# EAGLE design MI (EAGLE 7.6.0)
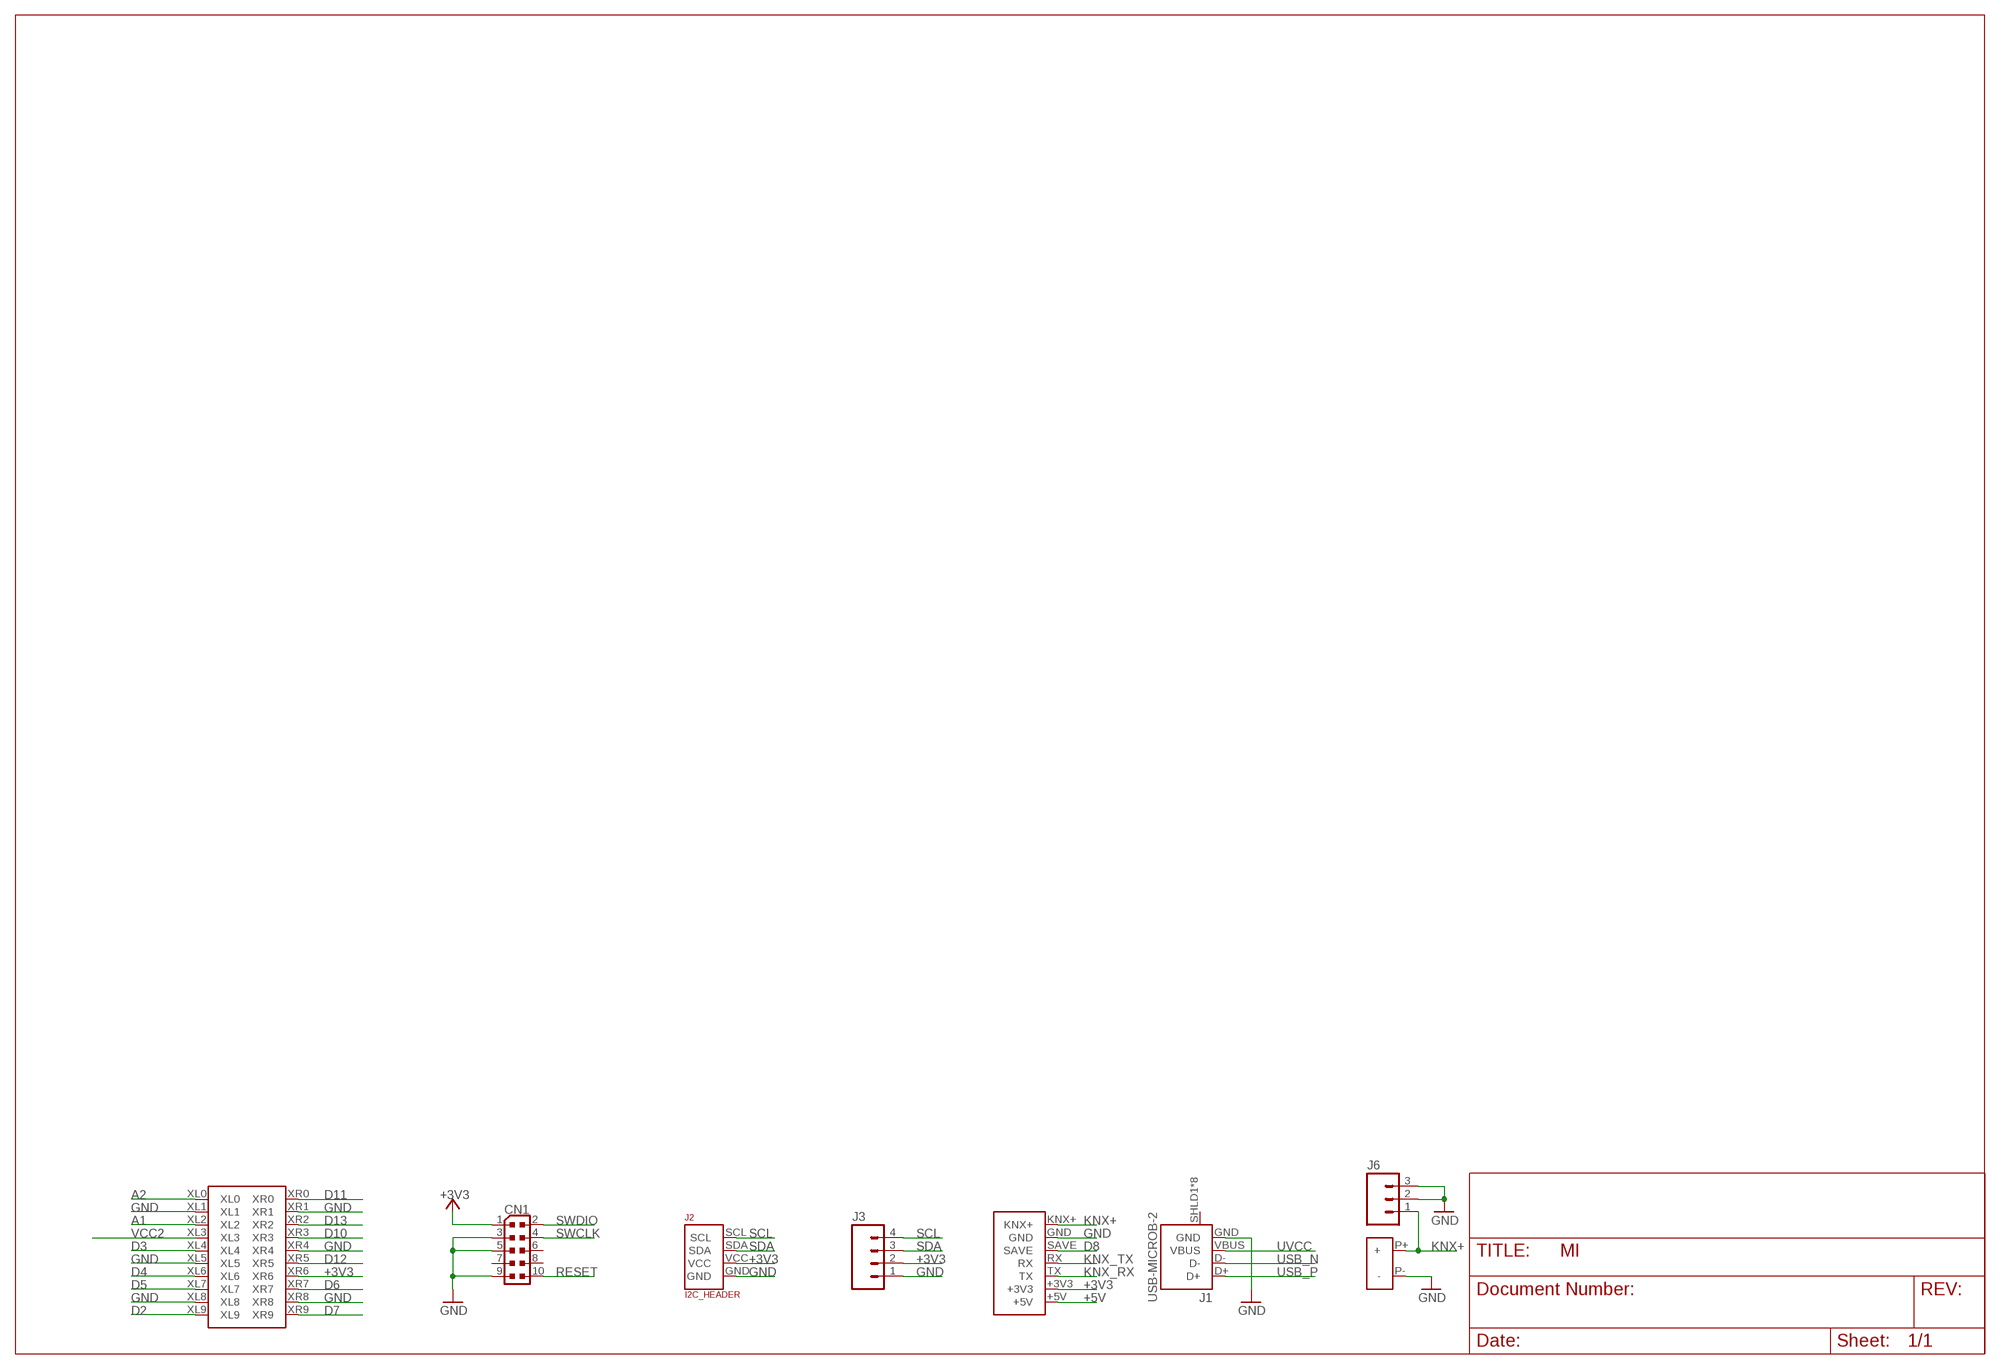
[diagram p0: schematic, sheet 1]

## Parts
CN1  0171_PH127-205DF055G00AROUND-PADS  [PINHEAD_2X05_127]
J1  USB-MICROB-2  [USB-MICROB-10118194]
J2  I2C_HEADER  [4_2.54_11.8X10.2MM]
J3  M04NO_SILK_ALL_ROUND  [1X04_NO_SILK_ALL_ROUND]
J6  M031X03_NO_SILK  [1X03_NO_SILK]
U$1  UFI2  [UFI_34X34MM]
U$2  KNX_KLEMME  [KNX_KLEMME]
U$3  MICRO_BCU_7_2.54DOCU_D1.4  [MICRO_BCU_7_2.54_D1.4_DOCU]

## Nets
+3V3: CN1.1 J2.VCC J3.2 U$1.XR6 U$3.+3V3
+5V: U$3.+5V
A1: U$1.XL2
A2: U$1.XL0
D2: U$1.XL9
D3: U$1.XL4
D4: U$1.XL6
D5: U$1.XL7
D6: U$1.XR7
D7: U$1.XR9
D8: U$3.SAVE
D10: U$1.XR3
D11: U$1.XR0
D12: U$1.XR5
D13: U$1.XR2
GND: CN1.3 CN1.5 CN1.9 J1.GND J2.GND J3.1 J6.2 J6.3 U$1.XL1 U$1.XL5 U$1.XL8 U$1.XR1 U$1.XR4 U$1.XR8 U$2.P-(-) U$3.GND
KNX+: J6.1 U$2.P+(+) U$3.KNX+
KNX_RX: U$3.TX
KNX_TX: U$3.RX
RESET: CN1.10
SCL: J2.SCL J3.4
SDA: J2.SDA J3.3
SWCLK: CN1.4
SWDIO: CN1.2
USB_N: J1.D-
USB_P: J1.D+
UVCC: J1.VBUS
VCC2: U$1.XL3
Unconnected: CN1.6 CN1.7 CN1.8 J1.SHLD1(SHIELD) J1.SHLD2(SHIELD) J1.SHLD3(SHIELD) J1.SHLD4(SHIELD) J1.SHLD5(SHIELD) J1.SHLD6(SHIELD) J1.SHLD7(SHIELD) J1.SHLD8(SHIELD)

## Library data of the parts
CN1 = Connettori:0171_PH127-205DF055G00A: 2x5 PASSO 1,27
J1 = we-con:USB: USB Connectors; DIGIKEY: 609-4618-6-ND
J2 = Connector_i2c:I2C_HEADER
J3 = SparkFun-Connectors:M04: Header 4 Standard 4-pin 0.1" header. Use with straight break away headers (SKU : PRT-00116), right angle break away headers (PRT-00553), swiss pins (PRT-00743), machine pins (PRT-00117), and female headers (PRT-00115). Molex polarized connector foot print use with SKU : PRT-08231 with associated crimp pins and housings. 1MM SMD Version SKU: PRT-10208; PROD_ID: CONN-09696
J6 = SparkFun-Connectors:M03: Header 3 Standard 3-pin 0.1" header. Use with straight break away headers (SKU : PRT-00116), right angle break away headers (PRT-00553), swiss pins (PRT-00743), machine pins (PRT-00117), and female headers (PRT-00115). Molex polarized connector foot print use with SKU : PRT-08232 with associated crimp pins and housings.
U$1 = UFI:UFI2
U$2 = Matthias_1:KNX_KLEMME
U$3 = MicroBCU_PCB:MICRO_BCU_7_2.54

## Net classes
0 default: width 0.203 mm
1 vcc: width 0.254 mm

## Board
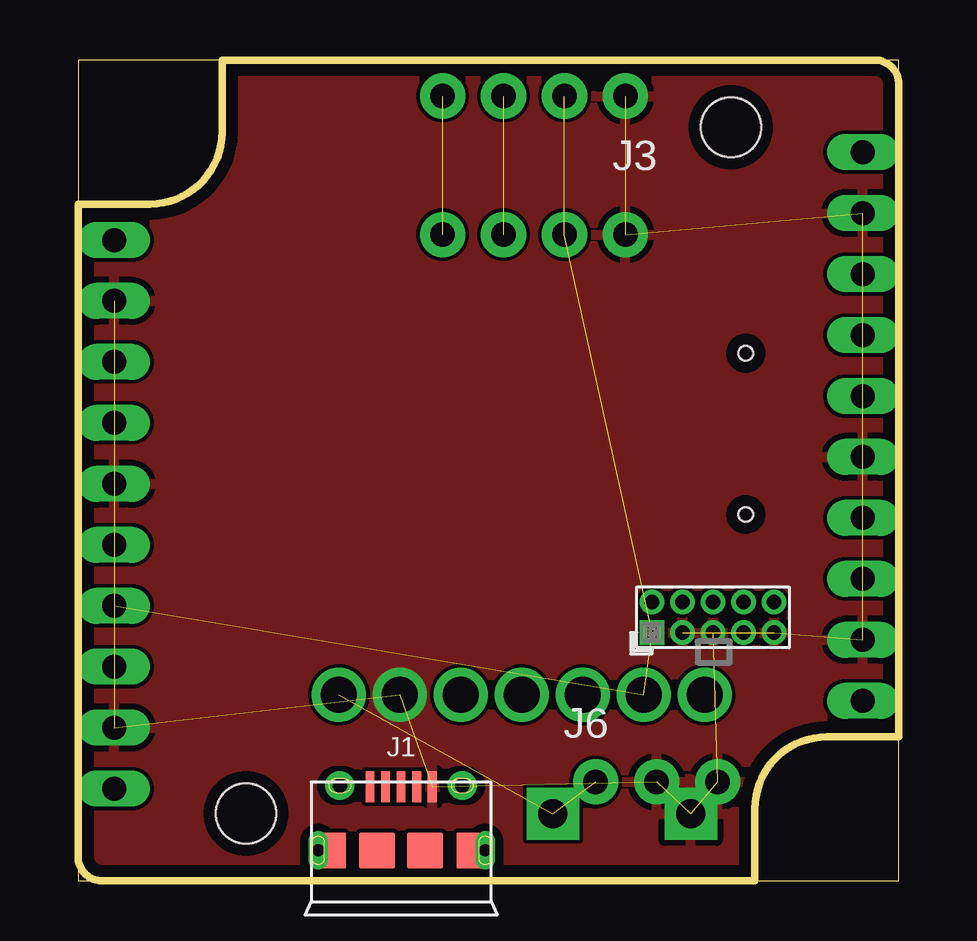
[diagram p1: board, top side]
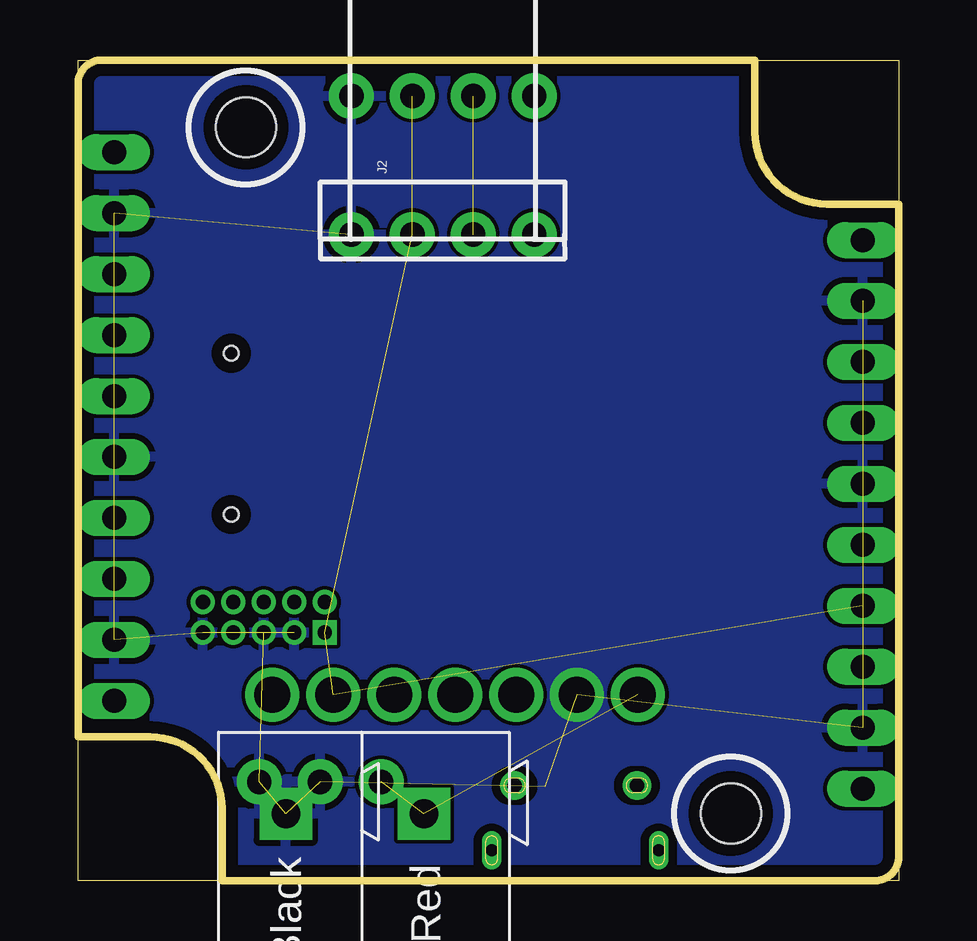
[diagram p2: board, bottom side, seen from below]

Size 34.2 x 34.2 mm. Coordinates in mm from the lower left corner, seen from the top.
Outline: 0,0 34.2,0 34.2,34.2 0,34.2 0,0
Copper layers (1*16): Top 0.035mm / dielectric 1.6mm / Bottom 0.035mm
Design rules "Elecrow_2-layer_PCB_eagle_rule": minimum track width 6mil, minimum drill 12mil, track to track 6mil, track to pad 6mil, pad to pad 6mil, via to via 8mil, smd to smd 0mil, copper to edge 20mil, drill to drill 10mil, minimum pad ring 6mil, minimum via ring 6mil, stop-mask expansion 0mil, vias tented up to drill 100mil, thermal gap 10mil
Holes 0.6 mm at 27.82,15.26 27.82,21.98

### Footprints (pad centres in the part's own frame; a part is rotated, then mirrored left to right if it is on the bottom)
PINHEAD_2X05_127 = drill 0.6 pad 1.016 square: 1 -0.635,2.54 | drill 0.6 pad 1.016: 2 0.635,2.54; 3 -0.635,1.27; 4 0.635,1.27; 5 -0.635,0; 6 0.635,0; 7 -0.635,-1.27; 8 0.635,-1.27; 9 -0.635,-2.54; 10 0.635,-2.54
USB-MICROB-10118194 = smd 1.3 x 0.4: D+ -2.5,0; D- -2.5,-0.65; GND -2.5,1.3; ID -2.5,0.65; VBUS -2.5,-1.3 | drill 0.6 pad 1.2: SHLD1 -2.55,2.55; SHLD2 -2.55,-2.55 | drill 0.5 pad 0.8 long: SHLD3 0.15,3.5; SHLD4 0.15,-3.45 | smd 1.5 x 1.1: SHLD5 0.15,2.85; SHLD6 0.15,-2.85 | smd 1.5 x 1.5: SHLD7 0.15,1; SHLD8 0.15,-1
4_2.54_11.8X10.2MM = drill 1.016 pad 1.88: GND -3.81,0; SCL 3.81,0; SDA 1.27,0; VCC -1.27,0
1X04_NO_SILK_ALL_ROUND = drill 1.016 pad 1.88: 1 0,0; 2 2.54,0; 3 5.08,0; 4 7.62,0
1X03_NO_SILK = drill 1.016 pad 1.88: 1 0,0; 2 2.54,0; 3 5.08,0
UFI_34X34MM = drill 1 long: XL0 1.5,30.36; XL1 1.5,27.82; XL2 1.5,25.28; XL3 1.5,22.74; XL4 1.5,20.2; XL5 1.5,17.66; XL6 1.5,15.12; XL7 1.5,12.58; XL8 1.5,10.04; XL9 1.5,7.5; XR0 32.7,26.7; XR1 32.7,24.16; XR2 32.7,21.62; XR3 32.7,19.08; XR4 32.7,16.54; XR5 32.7,14; XR6 32.7,11.46; XR7 32.7,8.92; XR8 32.7,6.38; XR9 32.7,3.84 | hole 2.5: 27.2,2.8; 7,31.4
KNX_KLEMME = drill 1.2 pad 2.184 square: P+ 0,-3.2; P- 0,2.55
MICRO_BCU_7_2.54_D1.4_DOCU = drill 1.5 pad 1.93: +3V3 6.35,-7.62; +5V 8.89,-7.62; GND -3.81,-7.62; KNX+ -6.35,-7.62; RX 1.27,-7.62; SAVE -1.27,-7.62; TX 3.81,-7.62

### Placement (x,y rotation side)
CN1  26.46,10.98 90 top
J1  13.46,1.42 270 top
J2  19,26.92 0 bottom
J3  22.81,32.7 180 top
J6  21.57,4.12 0 top
U$1  34.2,0 0 bottom
U$2  22.99,2.79 90 bottom
U$3  17.22,15.37 0 top

### Tracks (layer width: path | path; a pad name or v marks a point on that pad's centre or on a via)
+3V3  (4 unrouted)
GND  (15 unrouted)
  pour Top: 0,0 34.29,0 34.29,34.29 0,34.29
  pour Bottom: 0,0 34.29,0 34.29,34.29 0,34.29
KNX+  (2 unrouted)
SCL  (1 unrouted)
SDA  (1 unrouted)

### Text on the board
tValues: A0
tDocu: 3.3V | KNX+ | GND | D8 | TX | RX | 3V3 | 5V | 5V
bDocu: A2 | GND | D11 | SCL | SDA | 3V3 | GND | A1 | GND | VCC2 | D13 | D3 | D10 | GND | GND | D4 | D12 | D5 | 3V3 | GND | D6 | D2 | GND | D7